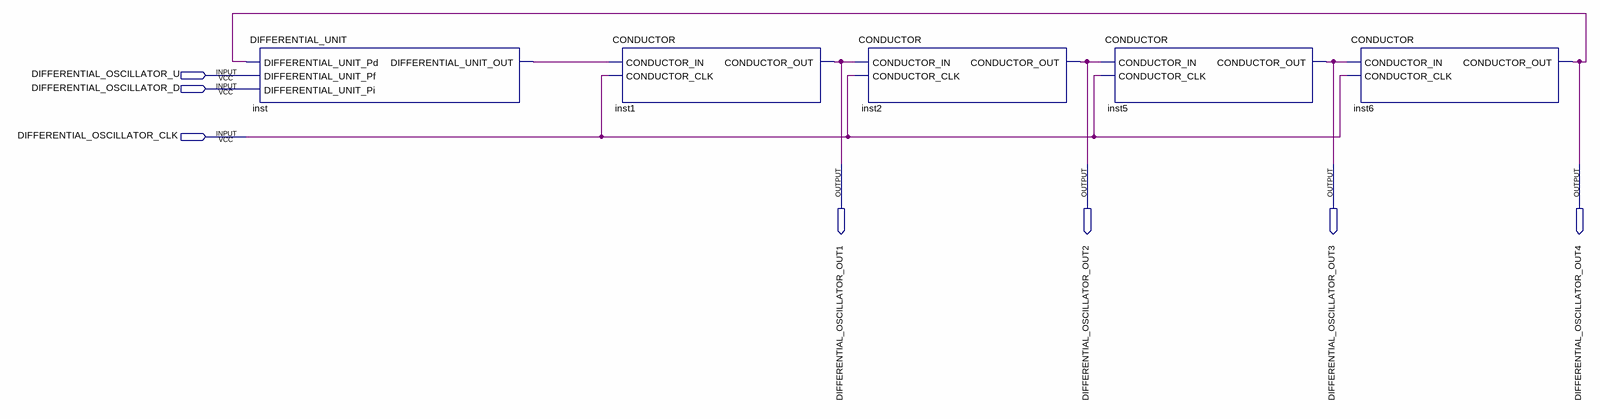
[diagram p0: schematic sheet]
// Quartus schematic DIFFERENTIAL_OSCILLATOR.bdf as structural Verilog: 5 symbols, 7 pins
module DIFFERENTIAL_OSCILLATOR (
  input  DIFFERENTIAL_OSCILLATOR_U,
  input  DIFFERENTIAL_OSCILLATOR_D,
  input  DIFFERENTIAL_OSCILLATOR_CLK,
  output DIFFERENTIAL_OSCILLATOR_OUT1,
  output DIFFERENTIAL_OSCILLATOR_OUT2,
  output DIFFERENTIAL_OSCILLATOR_OUT3,
  output DIFFERENTIAL_OSCILLATOR_OUT4
);

  wire inst_differential_unit_out;

  DIFFERENTIAL_UNIT inst (
    .DIFFERENTIAL_UNIT_Pd(DIFFERENTIAL_OSCILLATOR_OUT4), .DIFFERENTIAL_UNIT_Pf(DIFFERENTIAL_OSCILLATOR_U),
    .DIFFERENTIAL_UNIT_Pi(DIFFERENTIAL_OSCILLATOR_D), .DIFFERENTIAL_UNIT_OUT(inst_differential_unit_out));
  CONDUCTOR inst1 (
    .CONDUCTOR_IN(inst_differential_unit_out), .CONDUCTOR_CLK(DIFFERENTIAL_OSCILLATOR_CLK),
    .CONDUCTOR_OUT(DIFFERENTIAL_OSCILLATOR_OUT1));
  CONDUCTOR inst2 (
    .CONDUCTOR_IN(DIFFERENTIAL_OSCILLATOR_OUT1), .CONDUCTOR_CLK(DIFFERENTIAL_OSCILLATOR_CLK),
    .CONDUCTOR_OUT(DIFFERENTIAL_OSCILLATOR_OUT2));
  CONDUCTOR inst5 (
    .CONDUCTOR_IN(DIFFERENTIAL_OSCILLATOR_OUT2), .CONDUCTOR_CLK(DIFFERENTIAL_OSCILLATOR_CLK),
    .CONDUCTOR_OUT(DIFFERENTIAL_OSCILLATOR_OUT3));
  CONDUCTOR inst6 (
    .CONDUCTOR_IN(DIFFERENTIAL_OSCILLATOR_OUT3), .CONDUCTOR_CLK(DIFFERENTIAL_OSCILLATOR_CLK),
    .CONDUCTOR_OUT(DIFFERENTIAL_OSCILLATOR_OUT4));
endmodule
